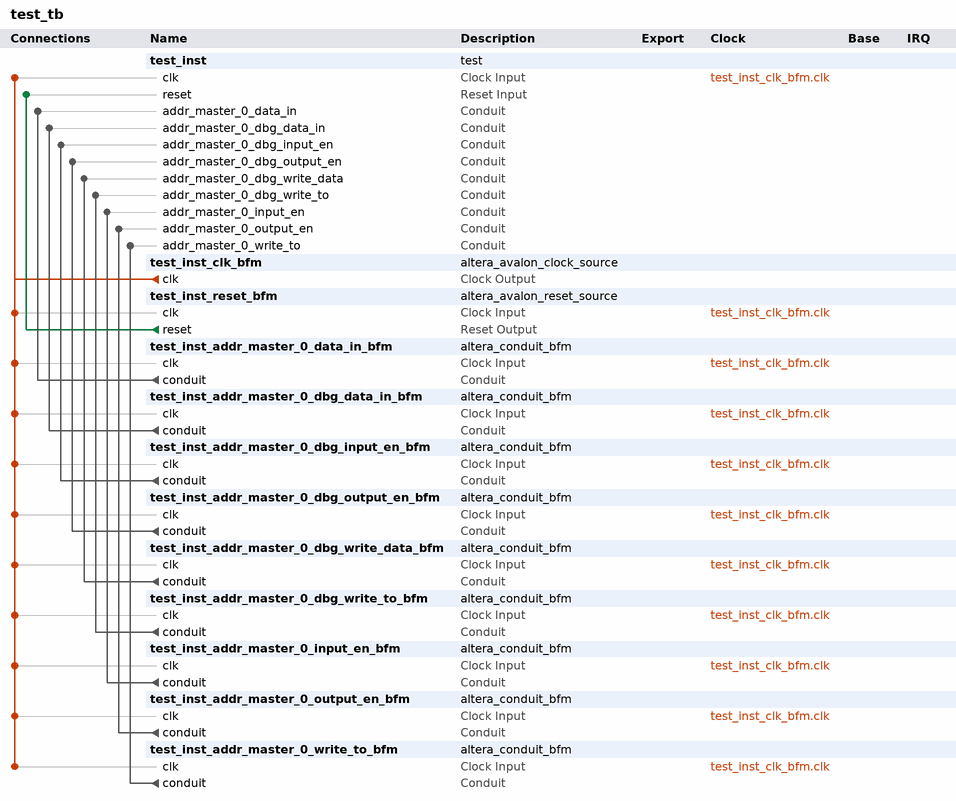
[diagram p0: system contents]
# Platform Designer (Qsys) system test_tb, Cyclone V 5CSEBA6U23I7
# Parameters at their usual value, and those the tool derives, are not listed.
package require -exact qsys 21.1
create_system test_tb
set_project_property DEVICE_FAMILY {Cyclone V}
set_project_property DEVICE 5CSEBA6U23I7

add_instance test_inst test 1.0

add_instance test_inst_clk_bfm altera_avalon_clock_source 21.1

add_instance test_inst_reset_bfm altera_avalon_reset_source 21.1
set_instance_parameter_value test_inst_reset_bfm ASSERT_HIGH_RESET 0
set_instance_parameter_value test_inst_reset_bfm INITIAL_RESET_CYCLES 50

add_instance test_inst_addr_master_0_data_in_bfm altera_conduit_bfm 21.1
set_instance_parameter_value test_inst_addr_master_0_data_in_bfm CLOCKED_SIGNAL true
set_instance_parameter_value test_inst_addr_master_0_data_in_bfm ENABLE_RESET false
set_instance_parameter_value test_inst_addr_master_0_data_in_bfm SIGNAL_DIRECTIONS output
set_instance_parameter_value test_inst_addr_master_0_data_in_bfm SIGNAL_ROLES condiut
set_instance_parameter_value test_inst_addr_master_0_data_in_bfm SIGNAL_WIDTHS 8

add_instance test_inst_addr_master_0_dbg_data_in_bfm altera_conduit_bfm 21.1
set_instance_parameter_value test_inst_addr_master_0_dbg_data_in_bfm CLOCKED_SIGNAL true
set_instance_parameter_value test_inst_addr_master_0_dbg_data_in_bfm ENABLE_RESET false
set_instance_parameter_value test_inst_addr_master_0_dbg_data_in_bfm SIGNAL_DIRECTIONS input
set_instance_parameter_value test_inst_addr_master_0_dbg_data_in_bfm SIGNAL_ROLES conduit
set_instance_parameter_value test_inst_addr_master_0_dbg_data_in_bfm SIGNAL_WIDTHS 8

add_instance test_inst_addr_master_0_dbg_input_en_bfm altera_conduit_bfm 21.1
set_instance_parameter_value test_inst_addr_master_0_dbg_input_en_bfm CLOCKED_SIGNAL true
set_instance_parameter_value test_inst_addr_master_0_dbg_input_en_bfm ENABLE_RESET false
set_instance_parameter_value test_inst_addr_master_0_dbg_input_en_bfm SIGNAL_DIRECTIONS input
set_instance_parameter_value test_inst_addr_master_0_dbg_input_en_bfm SIGNAL_ROLES conduit
set_instance_parameter_value test_inst_addr_master_0_dbg_input_en_bfm SIGNAL_WIDTHS 1

add_instance test_inst_addr_master_0_dbg_output_en_bfm altera_conduit_bfm 21.1
set_instance_parameter_value test_inst_addr_master_0_dbg_output_en_bfm CLOCKED_SIGNAL true
set_instance_parameter_value test_inst_addr_master_0_dbg_output_en_bfm ENABLE_RESET false
set_instance_parameter_value test_inst_addr_master_0_dbg_output_en_bfm SIGNAL_DIRECTIONS input
set_instance_parameter_value test_inst_addr_master_0_dbg_output_en_bfm SIGNAL_ROLES conduit
set_instance_parameter_value test_inst_addr_master_0_dbg_output_en_bfm SIGNAL_WIDTHS 1

add_instance test_inst_addr_master_0_dbg_write_data_bfm altera_conduit_bfm 21.1
set_instance_parameter_value test_inst_addr_master_0_dbg_write_data_bfm CLOCKED_SIGNAL true
set_instance_parameter_value test_inst_addr_master_0_dbg_write_data_bfm ENABLE_RESET false
set_instance_parameter_value test_inst_addr_master_0_dbg_write_data_bfm SIGNAL_DIRECTIONS input
set_instance_parameter_value test_inst_addr_master_0_dbg_write_data_bfm SIGNAL_ROLES conduit
set_instance_parameter_value test_inst_addr_master_0_dbg_write_data_bfm SIGNAL_WIDTHS 8

add_instance test_inst_addr_master_0_dbg_write_to_bfm altera_conduit_bfm 21.1
set_instance_parameter_value test_inst_addr_master_0_dbg_write_to_bfm CLOCKED_SIGNAL true
set_instance_parameter_value test_inst_addr_master_0_dbg_write_to_bfm ENABLE_RESET false
set_instance_parameter_value test_inst_addr_master_0_dbg_write_to_bfm SIGNAL_DIRECTIONS input
set_instance_parameter_value test_inst_addr_master_0_dbg_write_to_bfm SIGNAL_ROLES conduit
set_instance_parameter_value test_inst_addr_master_0_dbg_write_to_bfm SIGNAL_WIDTHS 3

add_instance test_inst_addr_master_0_input_en_bfm altera_conduit_bfm 21.1
set_instance_parameter_value test_inst_addr_master_0_input_en_bfm CLOCKED_SIGNAL true
set_instance_parameter_value test_inst_addr_master_0_input_en_bfm ENABLE_RESET false
set_instance_parameter_value test_inst_addr_master_0_input_en_bfm SIGNAL_DIRECTIONS output
set_instance_parameter_value test_inst_addr_master_0_input_en_bfm SIGNAL_ROLES conduit
set_instance_parameter_value test_inst_addr_master_0_input_en_bfm SIGNAL_WIDTHS 1

add_instance test_inst_addr_master_0_output_en_bfm altera_conduit_bfm 21.1
set_instance_parameter_value test_inst_addr_master_0_output_en_bfm CLOCKED_SIGNAL true
set_instance_parameter_value test_inst_addr_master_0_output_en_bfm ENABLE_RESET false
set_instance_parameter_value test_inst_addr_master_0_output_en_bfm SIGNAL_DIRECTIONS output
set_instance_parameter_value test_inst_addr_master_0_output_en_bfm SIGNAL_ROLES conduit
set_instance_parameter_value test_inst_addr_master_0_output_en_bfm SIGNAL_WIDTHS 1

add_instance test_inst_addr_master_0_write_to_bfm altera_conduit_bfm 21.1
set_instance_parameter_value test_inst_addr_master_0_write_to_bfm CLOCKED_SIGNAL true
set_instance_parameter_value test_inst_addr_master_0_write_to_bfm ENABLE_RESET false
set_instance_parameter_value test_inst_addr_master_0_write_to_bfm SIGNAL_DIRECTIONS output
set_instance_parameter_value test_inst_addr_master_0_write_to_bfm SIGNAL_ROLES conduit
set_instance_parameter_value test_inst_addr_master_0_write_to_bfm SIGNAL_WIDTHS 3

# connections
add_connection test_inst_clk_bfm.clk test_inst.clk clock
add_connection test_inst_clk_bfm.clk test_inst_addr_master_0_data_in_bfm.clk clock
add_connection test_inst_clk_bfm.clk test_inst_addr_master_0_dbg_data_in_bfm.clk clock
add_connection test_inst_clk_bfm.clk test_inst_addr_master_0_dbg_input_en_bfm.clk clock
add_connection test_inst_clk_bfm.clk test_inst_addr_master_0_dbg_output_en_bfm.clk clock
add_connection test_inst_clk_bfm.clk test_inst_addr_master_0_dbg_write_data_bfm.clk clock
add_connection test_inst_clk_bfm.clk test_inst_addr_master_0_dbg_write_to_bfm.clk clock
add_connection test_inst_clk_bfm.clk test_inst_addr_master_0_input_en_bfm.clk clock
add_connection test_inst_clk_bfm.clk test_inst_addr_master_0_output_en_bfm.clk clock
add_connection test_inst_clk_bfm.clk test_inst_addr_master_0_write_to_bfm.clk clock
add_connection test_inst_clk_bfm.clk test_inst_reset_bfm.clk clock
add_connection test_inst_reset_bfm.reset test_inst.reset reset
add_connection test_inst_addr_master_0_data_in_bfm.conduit test_inst.addr_master_0_data_in conduit
add_connection test_inst_addr_master_0_dbg_data_in_bfm.conduit test_inst.addr_master_0_dbg_data_in conduit
add_connection test_inst_addr_master_0_dbg_input_en_bfm.conduit test_inst.addr_master_0_dbg_input_en conduit
add_connection test_inst_addr_master_0_dbg_output_en_bfm.conduit test_inst.addr_master_0_dbg_output_en conduit
add_connection test_inst_addr_master_0_dbg_write_data_bfm.conduit test_inst.addr_master_0_dbg_write_data conduit
add_connection test_inst_addr_master_0_dbg_write_to_bfm.conduit test_inst.addr_master_0_dbg_write_to conduit
add_connection test_inst_addr_master_0_input_en_bfm.conduit test_inst.addr_master_0_input_en conduit
add_connection test_inst_addr_master_0_output_en_bfm.conduit test_inst.addr_master_0_output_en conduit
add_connection test_inst_addr_master_0_write_to_bfm.conduit test_inst.addr_master_0_write_to conduit

set_interconnect_requirement {$system} qsys_mm.clockCrossingAdapter HANDSHAKE
set_interconnect_requirement {$system} qsys_mm.enableEccProtection FALSE
set_interconnect_requirement {$system} qsys_mm.insertDefaultSlave FALSE
set_interconnect_requirement {$system} qsys_mm.maxAdditionalLatency 1

save_system test_tb.qsys
